# Altium schematic sheet Page-5.schdoc: OTG-USB
size 300 x 213 mm; CompanyName: InSYS; DrawnBy: NaveenKumar; Revision: 2.0; SheetNumber: 5; SheetTotal: 10; Title2: Gateway-Wirepas-Allwinner
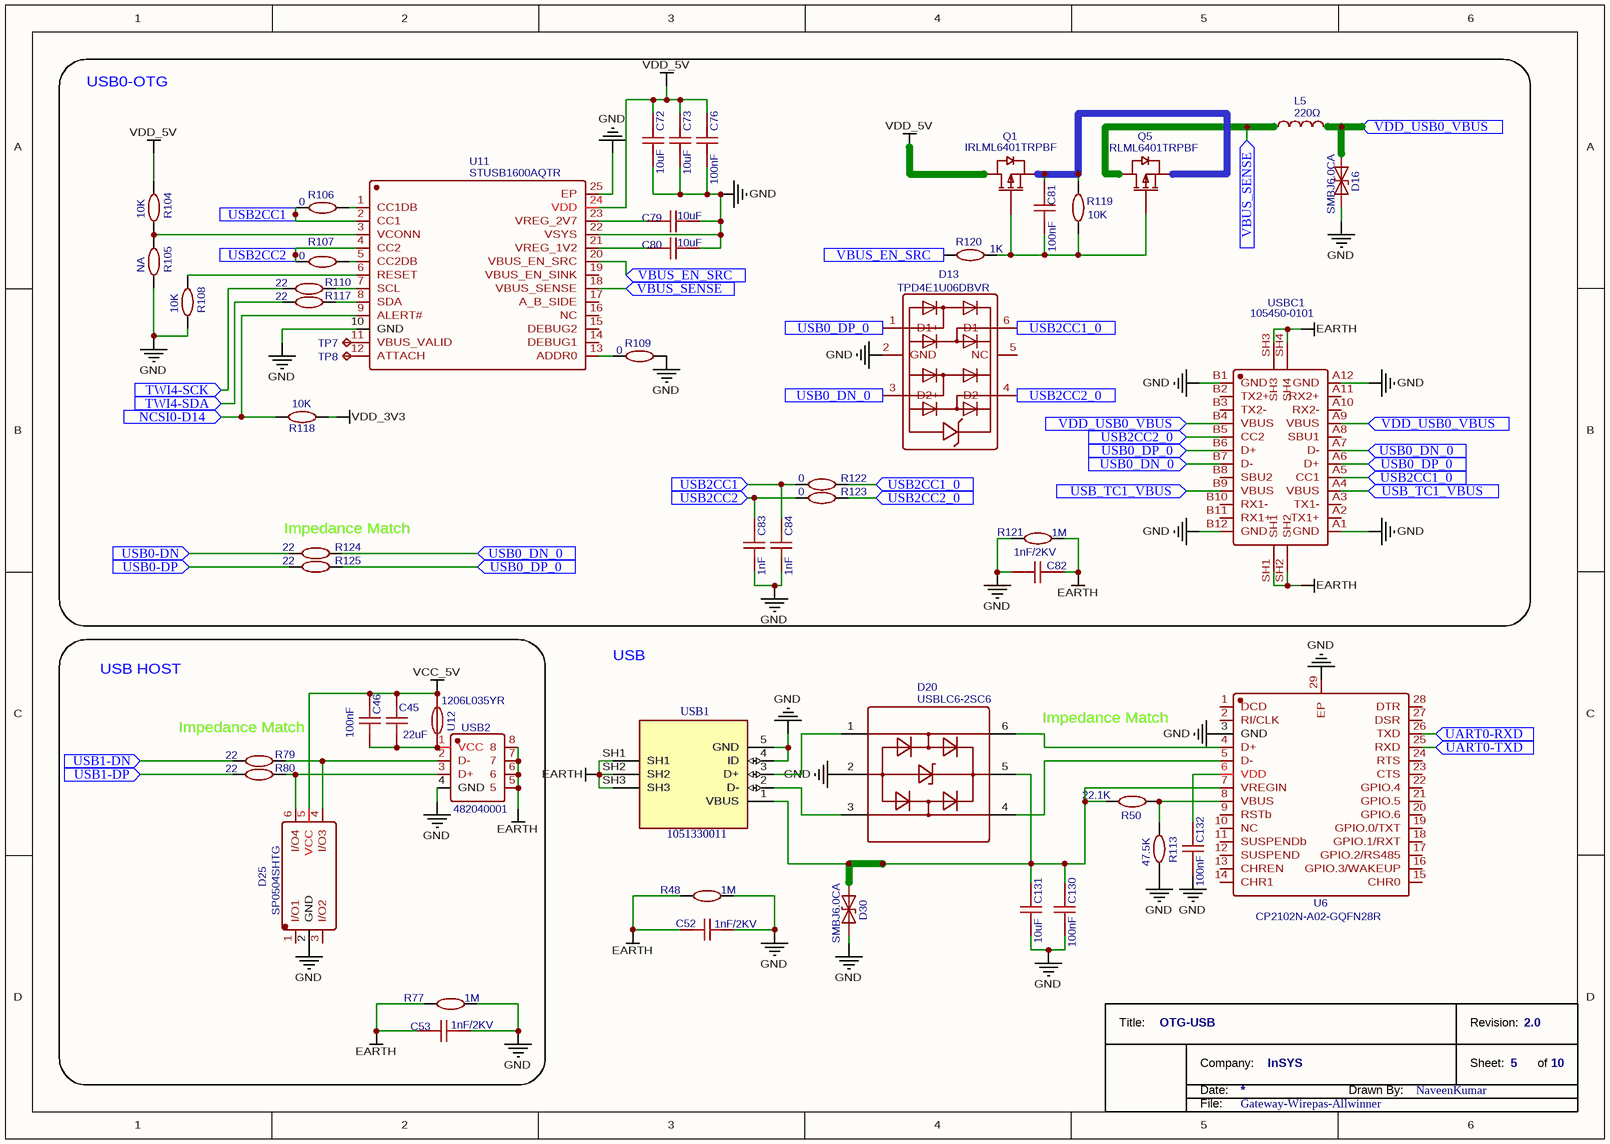
[diagram p0: Page-5.schdoc]

## Parts
*  TitleBlock_1  (value not drawn)  (graphical)
C45  22uF  [GWAY_Capacitor_0805]
C46  100nF  [GWAY_Capacitor_0603]
C52  1nF/2KV  [GWAY_Capacitor_1206]
C53  1nF/2KV  [GWAY_Capacitor_1206]
C72  10uF  [GWAY_Capacitor_0603]
C73  10uF  [GWAY_Capacitor_0603]
C76  100nF  [GWAY_Capacitor_0603]
C79  10uF  [GWAY_Capacitor_0805]
C80  10uF  [GWAY_Capacitor_0805]
C81  100nF  [GWAY_Capacitor_0603]
C82  1nF/2KV  [GWAY_Capacitor_1206]
C83  1nF  [GWAY_Capacitor_0603]
C84  1nF  [GWAY_Capacitor_0603]
C130  100nF  [GWAY_Capacitor_0603]
C131  10uF  [GWAY_Capacitor_0805]
C132  100nF  [GWAY_Capacitor_0603]
D13  TPD4E1U06DBVR  [GWAY_SOT23-6PIN]
D16  SMBJ6.0CA  [GWAY_DIODE_SMB_DO214AA]
D20  USBLC6-2SC6  [GWAY_SOT23-6PIN]
D25  SP0504SHTG  [GWAY_SOT23-6PIN]
D30  SMBJ6.0CA  [GWAY_DIODE_SMB_DO214AA]
L5  220Ω  [GWAY_FerriteeBEAD_0805_C2012X105N]
Q1  IRLML6401TRPBF  [GWAY_SOT23-3PIN]
Q5  IRLML6401TRPBF  [GWAY_SOT23-3PIN]
R48  1M  [GWAY_Resistor_0603]
R50  22.1K  [GWAY_Resistor_0603]
R77  1M  [GWAY_Resistor_0603]
R79  22  [GWAY_Resistor_0603]
R80  22  [GWAY_Resistor_0603]
R104  10K  [GWAY_Resistor_0603]
R105  NA  [GWAY_Resistor_0603]
R106  0  [GWAY_Resistor_0603]
R107  0  [GWAY_Resistor_0603]
R108  10K  [GWAY_Resistor_0603]
R109  0  [GWAY_Resistor_0603]
R110  22  [GWAY_Resistor_0603]
R113  47.5K  [GWAY_Resistor_0603]
R117  22  [GWAY_Resistor_0603]
R118  10K  [GWAY_Resistor_0603]
R119  10K  [GWAY_Resistor_0603]
R120  1K  [GWAY_Resistor_0603]
R121  1M  [GWAY_Resistor_0603]
R122  0  [GWAY_Resistor_0603]
R123  0  [GWAY_Resistor_0603]
R124  22  [GWAY_Resistor_0603]
R125  22  [GWAY_Resistor_0603]
TP7  TP-052-TJ  [GWAY_TESTPOINT1]  (value not drawn)
TP8  TP-052-TJ  [GWAY_TESTPOINT1]  (value not drawn)
U6  CP2102N-A02-GQFN28R  [GWAY_QFN_28PIN_EP]
U11  STUSB1600AQTR  [GWAY_QFN_24PIN_4X4X1-25N]
U12  1206L035YR  [GWAY_FUSE1206]
USB1  1051330011  [GWAY_MOLEX_1051330011]
USB2  482040001  [GWAY_USB_TYPE_A_48204-0001_1]
USBC1  105450-0101  [GWAY_MOLEX_1054500101]

## Ports
NCSI0-D14 (in), TWI4-SCK (in), TWI4-SDA (in), UART0-RXD (in), UART0-TXD (in), USB0-DN (in), USB0-DP (in), USB0_DN_0 (in), USB0_DP_0 (in), USB1-DN (in), USB1-DP (in), USB2CC1 (in), USB2CC1_0 (in), USB2CC2 (in), USB2CC2_0 (in), USB_TC1_VBUS (in), VBUS_EN_SRC (in), VBUS_SENSE (in), VDD_USB0_VBUS (in)

## Nets
EARTH: C52.2 C53.2 C82.1 R48.1 R77.1 R121.2 USB1.SH1 USB1.SH2 USB1.SH3 USB2.5 USB2.6 USB2.7 USB2.8 USBC1.SH1 USBC1.SH2 USBC1.SH3 USBC1.SH4
GND: C52.1 C53.1 C72.1 C73.2 C76.2 C79.2 C80.2 C82.2 C83.2 C84.2 C130.1 C131.1 C132.1 D13.2(GND) D16.2(A) D20.2 D25.2(GND) D30.2(A) R48.2 R77.2 R105.2 R108.2 R109.1 R113.1 R121.1 U6.3(GND) U6.29(EP) U11.10(GND) U11.22(VSYS) U11.25(EP) USB1.4(ID) USB1.5(GND) USB2.4(GND) USBC1.A1(GND) USBC1.A12(GND) USBC1.B1(GND) USBC1.B12(GND)
VCC_5V: C45.2 C46.1 D25.5(VCC) U12.2
VDD_3V3: R118.2
VDD_5V: C72.2 C73.1 C76.1 Q1.3(D) R104.1 U11.24(VDD)
NCSI0-D14: R118.1 U11.9(ALERT#) ; port NCSI0-D14
TWI4-SCK: R110.1 ; port TWI4-SCK
TWI4-SDA: R117.1 ; port TWI4-SDA
UART0-RXD: U6.26(TXD) ; port UART0-RXD
UART0-TXD: U6.25(RXD) ; port UART0-TXD
USB0-DN: R124.1 ; port USB0-DN
USB0-DP: R125.1 ; port USB0-DP
USB0_DN_0: D13.3(D2+) R124.2 USBC1.A7(D-) USBC1.B7(D-) ; port USB0_DN_0
USB0_DP_0: D13.1(D1+) R125.2 USBC1.A6(D+) USBC1.B6(D+) ; port USB0_DP_0
USB1-DN: R79.1 ; port USB1-DN
USB1-DP: R80.1 ; port USB1-DP
USB2CC1: C84.1 R106.2 R122.2 U11.2(CC1) ; port USB2CC1
USB2CC1_0: D13.6(D1-) R122.1 USBC1.A5(CC1) ; port USB2CC1_0
USB2CC2: C83.1 R107.2 R123.2 U11.4(CC2) ; port USB2CC2
USB2CC2_0: D13.4(D2-) R123.1 USBC1.B5(CC2) ; port USB2CC2_0
USB_TC1_VBUS: USBC1.A4(VBUS) USBC1.B9(VBUS) ; port USB_TC1_VBUS
VBUS_EN_SRC: R120.1 U11.20(VBUS_EN_SRC) ; port VBUS_EN_SRC
VBUS_SENSE: L5.1 Q5.3(D) U11.18(VBUS_SENSE) ; port VBUS_SENSE
VDD_USB0_VBUS: D16.1(K) L5.2 USBC1.A9(VBUS) USBC1.B4(VBUS) ; port VDD_USB0_VBUS
NetC45_1: C45.1 C46.2 U12.1 USB2.1(VCC)
NetC79_1: C79.1 U11.23(VREG_2V7)
NetC80_1: C80.1 U11.21(VREG_1V2)
NetC81_1: C81.1 Q1.2(S) Q5.2(S) R119.2
NetC81_2: C81.2 Q1.1(G) Q5.1(G) R119.1 R120.2
NetC130_2: C130.2 C131.2 D20.5 D30.1(K) R50.1 U6.7(VREGIN) USB1.1(VBUS)
NetC132_2: C132.2 U6.6(VDD)
NetD20_1: D20.1 USB1.3(D+)
NetD20_3: D20.3 USB1.2(D-)
NetD20_4: D20.4 U6.5(D-)
NetD20_6: D20.6 U6.4(D+)
NetD25_4: D25.4(I/O3) R79.2 USB2.2(D-)
NetD25_6: D25.6(I/O4) R80.2 USB2.3(D+)
NetR50_2: R50.2 R113.2 U6.8(VBUS)
NetR104_2: R104.2 R105.1 U11.3(VCONN)
NetR106_1: R106.1 U11.1(CC1DB)
NetR107_1: R107.1 U11.5(CC2DB)
NetR108_1: R108.1 U11.6(RESET)
NetR109_2: R109.2 U11.13(ADDR0)
NetR110_2: R110.2 U11.7(SCL)
NetR117_2: R117.2 U11.8(SDA)
NetTP7_1: TP7.1 U11.11(VBUS_VALID)
NetTP8_1: TP8.1 U11.12(ATTACH)

Not connected (* = marked no-connect by the designer): D13 5(NC); D25 1(I/O1) 3(I/O2); U6 1(DCD) 2(RI/CLK) 9(RSTb) 10(NC) 11(SUSPENDb) 12(SUSPEND) 13(CHREN) 14(CHR1) 15(CHR0) 16(GPIO.3/WAKEUP) 17(GPIO.2/RS485) 18(GPIO.1/RXT) 19(GPIO.0/TXT) 20(GPIO.6) 21(GPIO.5) 22(GPIO.4) 23(CTS) 24(RTS) 27(DSR) 28(DTR); U11 14(DEBUG1) 15(DEBUG2) 16(NC) 17(A_B_SIDE) 19(VBUS_EN_SINK); USBC1 A2(TX1+) A3(TX1-) A8(SBU1) A10(RX2-) A11(RX2+) B2(TX2+) B3(TX2-) B8(SBU2) B10(RX1-) B11(RX1+)

## Notes on the sheet
- USB0-OTG
- (near R124) Impedance Match
- USB HOST
- USB
- Impedance Match
- (in symbol TitleBlock_1) Title:; Revision:; Company:; Sheet:; of; Date:; Drawn By:; File:

## Library data of the parts
* = TitleBlock_1: TitleBlock  No-2; TitleName: *; Company: *; Drawn By: *; File: *
C45 = 22uF: Manufacturer: SAMSUNG; Manufacturer Part: CL21A226MQQNNNE; nameAlias: Capacitance; Supplier: LCSC; Supplier Part: C5674; spicePre: C; spiceSymbolName: CL21A226MQQNNNE
C46 C76 C81 C130 C132 = 100nF: Manufacturer: SAMSUNG; Manufacturer Part: CL10B104KB8NNNC; nameAlias: Capacitance; Supplier: LCSC; Supplier Part: C1591; spicePre: C; spiceSymbolName: CL10B104KB8NNNC
C52 C53 C82 = 1nF/2KV: Manufacturer: Walsin Tech Corp; Manufacturer Part: 1206B102K202CT; nameAlias: Capacitance; Contributor: LCSC; Supplier: LCSC; Supplier Part: C303946; spicePre: C; spiceSymbolName: 1206B102K202CT
C72 C73 C79 C80 C131 = 10uF: Manufacturer: SAMSUNG(三星); Manufacturer Part: CL21B106KOQNNNE; nameAlias: Capacitance; Supplier: LCSC; Supplier Part: C95841; JLCPCB Part Class: Extended Part; spicePre: C; spiceSymbolName: CL21B106KOQNNNE
C83 C84 = 1nF: Manufacturer: SAMSUNG(三星); Manufacturer Part: CL10C102JB8NNNC; nameAlias: Capacitance; Contributor: LCSC; Supplier: LCSC; Supplier Part: C163508; JLCPCB Part Class: Extended Part; spicePre: C; spiceSymbolName: CL10C102JB8NNNC
D13 = TPD4E1U06DBVR: Manufacturer: TI(德州仪器); Contributor: LCSC; Supplier: LCSC; Supplier Part: C124691; Manufacturer Part: TPD4E1U06DBVR; JLCPCB Part Class: Extended Part; spicePre: D; spiceSymbolName: TPD4E1U06DBVR
D16 D30 = SMBJ6.0CA: Manufacturer Part: SMBJ6.0CA-E3/52; Manufacturer: VISHAY; SMT Type: Extend; Supplier: LCSC; image: //image.lceda.cn/szlcsc/C83659.jpg; Supplier Part: C83659; LCSC Assembly: Yes; spicePre: D
D20 = USBLC6-2SC6: Manufacturer: STMicroelectronics; Supplier: LCSC; Manufacturer Part: USBLC6-2SC6; Supplier Part: C7519; JLCPCB Part Class: Extended Part; spicePre: D; spiceSymbolName: USBLC6-2SC6
D25 = SP0504SHTG: Manufacturer: Littelfuse; Contributor: LCSC; Supplier: LCSC; Supplier Part: C207264; Manufacturer Part: SP0504SHTG; spicePre: D
L5 = 220Ω: Manufacturer: muRata(村田); Manufacturer Part: BLM21PG221SN1D; nameAlias: Value; Supplier: LCSC; Supplier Part: C85840; JLCPCB Part Class: Extended Part; spicePre: L; spiceSymbolName: BLM21PG221SN1D
Q1 Q5 = IRLML6401TRPBF: Manufacturer: Infineon(英飞凌); Supplier: LCSC; Manufacturer Part: IRLML6401TRPBF; Supplier Part: C3034; JLCPCB Part Class: Extended Part; spicePre: Q; spiceSymbolName: IRLML6401TRPBF
R48 R77 R121 = 1M: Manufacturer: YAGEO; Manufacturer Part: RC0603FR-071ML; nameAlias: Resistance (Ohms); Supplier: LCSC; Supplier Part: C105578; spicePre: R; spiceSymbolName: RC0603FR-071ML
R50 = 22.1K: Manufacturer: YAGEO; Manufacturer Part: RC0603JR-0710KL; nameAlias: Resistance (Ohms); Supplier: LCSC; Supplier Part: C99198; spicePre: R; spiceSymbolName: RC0603JR-0710KL
R79 R80 R110 R117 R124 R125 = 22: Manufacturer: YAGEO; Manufacturer Part: RC0603FR-0722RL; nameAlias: Resistance (Ohms); Supplier: LCSC; Supplier Part: C107701; spicePre: R; spiceSymbolName: RC0603FR-0722RL
R104 R108 R118 R119 = 10K: Manufacturer: YAGEO; Manufacturer Part: RC0603JR-0710KL; nameAlias: Resistance (Ohms); Supplier: LCSC; Supplier Part: C99198; spicePre: R; spiceSymbolName: RC0603JR-0710KL
R105 = NA: Manufacturer: YAGEO; Manufacturer Part: RC0603JR-0710KL; nameAlias: Resistance (Ohms); Supplier: LCSC; Supplier Part: C99198; spicePre: R; spiceSymbolName: RC0603JR-0710KL
R106 R107 R109 R122 R123 = 0: Manufacturer: YAGEO; Manufacturer Part: RC0603FR-070RL; nameAlias: Resistance (Ohms); Supplier: LCSC; Supplier Part: C100044; spicePre: R; spiceSymbolName: RC0603FR-070RL
R113 = 47.5K: Manufacturer: YAGEO; Manufacturer Part: RC0603JR-0710KL; nameAlias: Resistance (Ohms); Supplier: LCSC; Supplier Part: C99198; spicePre: R; spiceSymbolName: RC0603JR-0710KL
R120 = 1K: Manufacturer Part: RC0603FR-071KL; Manufacturer: YAGEO; nameAlias: Resistance (Ohms); Supplier: LCSC; Supplier Part: C22548; spicePre: R; spiceSymbolName: RC0603FR-071KL
U6 = CP2102N-A02-GQFN28R: Manufacturer: SILICON LABS(芯科); Contributor: LCSC; Supplier: LCSC; Supplier Part: C964632; JLCPCB Part Class: Extended Part; spicePre: U; spiceSymbolName: CP2102N-A02-GQFN28R
U11 = STUSB1600AQTR: Manufacturer: ST(意法半导体); Contributor: LCSC; Supplier: LCSC; Supplier Part: C2156023; Manufacturer Part: STUSB1600AQTR; JLCPCB Part Class: Extended Part; spicePre: U; spiceSymbolName: STUSB1600AQTR
U12 = 1206L035YR: Manufacturer: Littelfuse; Supplier: LCSC; Manufacturer Part: 1206L035YR; Supplier Part: C99562; JLCPCB Part Class: Extended Part; spicePre: U; spiceSymbolName: 1206L035YR
USB1 = USB_1051330011: USB - micro B USB 2.0 Receptacle Connector 5 Position Surface Mount; MF: Molex; SnapEDA_Link: https://www.snapeda.com/parts/1051330011/Molex/view-part/?ref=snap; Package: None; Value: *; MP: 1051330011; Check_prices: https://www.snapeda.com/parts/1051330011/Molex/view-part/?ref=eda
USB2 = 482040001: Manufacturer: MOLEX; Contributor: LCSC; Supplier: LCSC; Supplier Part: C505247; Manufacturer Part: 482040001; JLCPCB Part Class: Extended Part; spicePre: U; spiceSymbolName: 482040001
USBC1 = 105450-0101: Manufacturer: MOLEX; Manufacturer Part: 1054500101; Contributor: LCSC; Supplier: LCSC; Supplier Part: C134092; JLCPCB Part Class: Extended Part; spicePre: U; spiceSymbolName: 105450-0101
TP7 TP8 = TP-052-TJ: Manufacturer Part: ?; spicePre: T